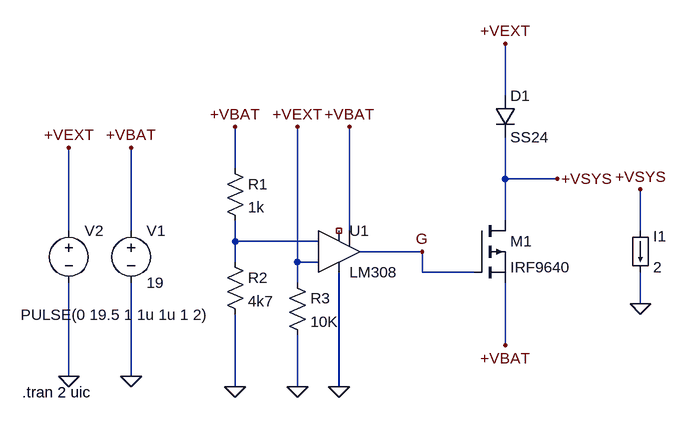
[diagram p0: schematic Prueba Desconexion Bateria.asc]
Prueba Desconexion Bateria.asc, the LTspice schematic file:
Version 4.1
SHEET 1 880 680
WIRE -32 -112 -32 -192
WIRE -448 0 -448 -64
WIRE -32 16 -32 -48
WIRE 48 16 -32 16
WIRE -32 80 -32 16
WIRE -704 96 -704 -32
WIRE -608 96 -608 -32
WIRE -272 96 -272 -64
WIRE 176 96 176 32
WIRE -448 112 -448 80
WIRE -320 112 -448 112
WIRE -160 128 -256 128
WIRE -448 144 -448 112
WIRE -352 144 -352 -64
WIRE -320 144 -352 144
WIRE -160 160 -160 128
WIRE -80 160 -160 160
WIRE -352 176 -352 144
WIRE 176 208 176 160
WIRE -32 272 -32 176
WIRE -704 320 -704 176
WIRE -608 320 -608 176
WIRE -448 336 -448 224
WIRE -352 336 -352 256
WIRE -288 336 -288 160
FLAG -608 320 0
FLAG -608 -32 +VBAT
FLAG -704 320 0
FLAG -704 -32 +VEXT
FLAG -32 272 +VBAT
FLAG -32 -192 +VEXT
FLAG 48 16 +VSYS
FLAG -448 336 0
FLAG -448 -64 +VBAT
FLAG -352 -64 +VEXT
FLAG -352 336 0
FLAG -288 336 0
FLAG -272 -64 +VBAT
FLAG -160 128 G
FLAG 176 208 0
FLAG 176 32 +VSYS
SYMBOL voltage -608 80 R0
WINDOW 123 0 0 Left 0
WINDOW 39 0 0 Left 0
SYMATTR InstName V1
SYMATTR Value 19
SYMBOL voltage -704 80 R0
WINDOW 3 -74 145 Left 2
WINDOW 123 0 0 Left 0
WINDOW 39 0 0 Left 0
SYMATTR InstName V2
SYMATTR Value PULSE(0 19.5 1 1u 1u 1 2)
SYMBOL pmos -80 80 R0
SYMATTR InstName M1
SYMATTR Value IRF9640
SYMBOL diode -48 -112 R0
SYMATTR InstName D1
SYMATTR Value SS24
SYMATTR Description Diode
SYMATTR Type diode
SYMBOL OpAmps\\LM308 -288 64 R0
SYMATTR InstName U1
SYMBOL res -464 -16 R0
SYMATTR InstName R1
SYMATTR Value 1k
SYMBOL res -464 128 R0
SYMATTR InstName R2
SYMATTR Value 4k7
SYMBOL res -368 160 R0
SYMATTR InstName R3
SYMATTR Value 10K
SYMBOL load 160 96 R0
WINDOW 123 0 0 Left 0
WINDOW 39 0 0 Left 0
SYMATTR InstName I1
SYMATTR Value 2
TEXT -776 344 Left 2 !.tran 2 uic

The netlist it stands for:
* Prueba Desconexion Bateria.asc
V1 +VBAT 0 19
V2 +VEXT 0 PULSE(0 19.5 1 1u 1u 1 2)
M1 +VSYS G +VBAT +VBAT IRF9640
D1 +VEXT +VSYS SS24
X§U1 +VEXT N001 +VBAT 0 G NC_01 NC_02 LT1008
R1 +VBAT N001 1k
R2 N001 0 4k7
R3 +VEXT 0 10K
I1 +VSYS 0 2
.model D D
.lib standard.dio
.model NMOS NMOS
.model PMOS PMOS
.lib standard.mos
.tran 2 uic
.lib LTC.lib
.backanno
.end

* Results of the author's LTspice run, read from the files saved beside the schematic
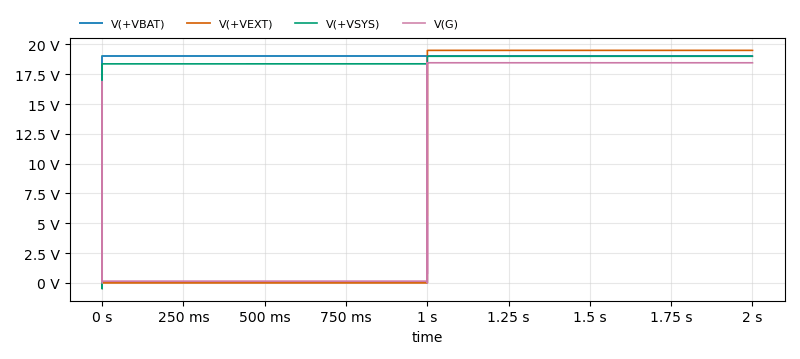
[diagram p1: Transient Analysis of Prueba Desconexion Bateria.asc, plotted from the saved traces]
* Transient Analysis, 1 run:
*   V(+VBAT): min 0 V, max 19 V, average 19 V, rms 19 V, last 19 V
*   V(+VEXT): min 0 V, max 19.5 V, average 9.75 V, rms 13.79 V, last 19.5 V
*   V(+VSYS): min -494.8 mV, max 19.01 V, average 18.69 V, rms 18.69 V, last 19.01 V
*   V(G): min 0 V, max 18.46 V, average 9.302 V, rms 13.05 V, last 18.46 V